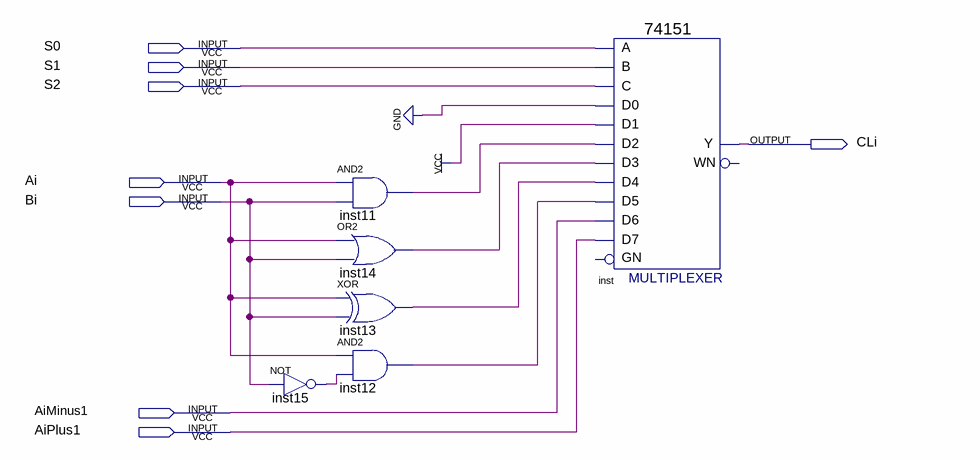
[diagram p0: schematic sheet]
// Quartus schematic logiccircuit1bit.bdf as structural Verilog: 6 symbols, 8 pins
module logiccircuit1bit (
  input  S0,
  input  S1,
  input  S2,
  input  Ai,
  input  Bi,
  input  AiMinus1,
  input  AiPlus1,
  output CLi
);

  wire inst11_out, inst12_out, inst13_out, inst14_out, inst15_out;

  not inst15 (inst15_out, Bi);
  and inst11 (inst11_out, Ai, Bi);
  or inst14 (inst14_out, Ai, Bi);
  xor inst13 (inst13_out, Ai, Bi);
  and inst12 (inst12_out, Ai, inst15_out);
  \74151  inst (
    .C(S2), .B(S1), .A(S0), .D5(inst12_out), .D0(1'b0), .D1(1'b1), .D4(inst13_out), .D3(inst14_out),
    .D2(inst11_out), .D6(AiMinus1), .D7(AiPlus1), .Y(CLi));  // open: GN, WN
endmodule
